# Altium project EMDO601_Patch.PrjPcb
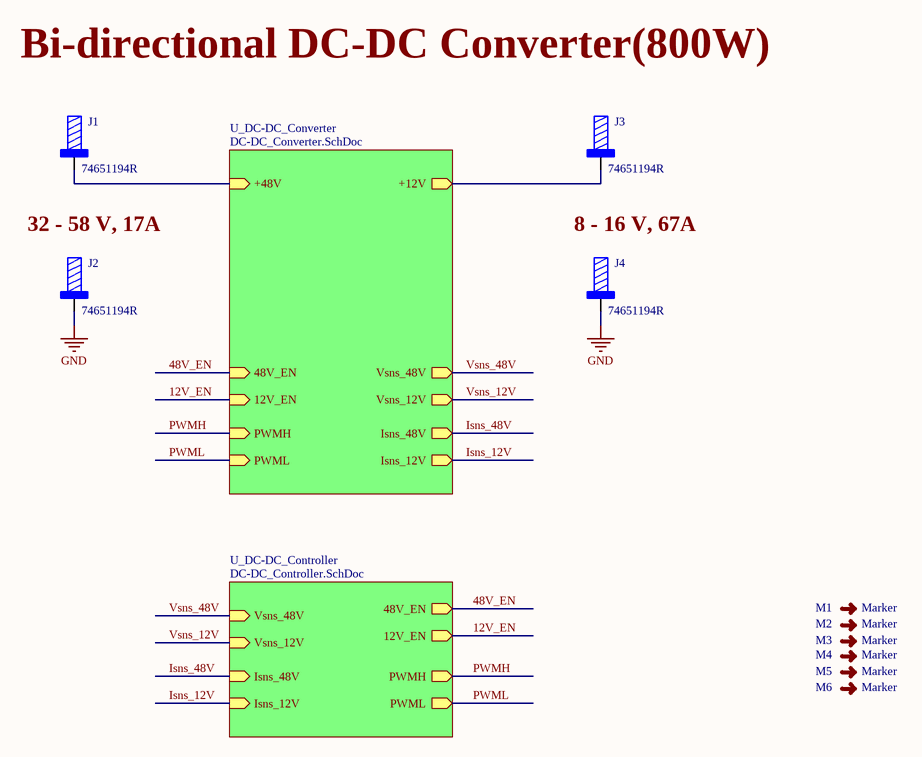
[diagram p0: Main.SchDoc]
1 sheet, 10 parts. Net scope: hierarchical (ports join the sheet entries above them; power ports are global).
Board file: EMDO601_Patch.PcbDoc

## Sheet Main.SchDoc: Balancer_48V
size A4; CompanyName: swissEmbedded GmbH; Organization: swissEmbedded GmbH; Address1: Landstrasse 18; Address2: 5415 Rieden; Address3: Switzerland; Address4: info@swissembedded.com; DocumentNumber: 1; Revision: A; SheetNumber: 1; SheetTotal: 27

### Parts
J1  74651194R  [74651194]
J2  74651194R  [74651194]
J3  74651194R  [74651194]
J4  74651194R  [74651194]
M1  Marker  [PASSER-KREIS]  (no BOM)
M2  Marker  [PASSER-KREIS]  (no BOM)
M3  Marker  [PASSER-KREIS]  (no BOM)
M4  Marker  [PASSER-KREIS]  (no BOM)
M5  Marker  [PASSER-KREIS]  (no BOM)
M6  Marker  [PASSER-KREIS]  (no BOM)

### Sub-sheets
U_DC-DC_Controller = DC-DC_Controller.SchDoc (file not in this document): Vsns_48V (in), Vsns_12V (in), Isns_48V (in), PWMH (out), PWML (out), 48V_EN (out), 12V_EN (out), Isns_12V (in)
U_DC-DC_Converter = DC-DC_Converter.SchDoc (file not in this document): +48V, +12V, PWMH (in), PWML (in), Vsns_48V (out), Vsns_12V (out), Isns_48V (out), 48V_EN (in), 12V_EN (in), Isns_12V (out)

### Nets
GND: J2.1 J4.1
12V_EN: sheet U_DC-DC_Converter/12V_EN, sheet U_DC-DC_Controller/12V_EN
48V_EN: sheet U_DC-DC_Converter/48V_EN, sheet U_DC-DC_Controller/48V_EN
Isns_12V: sheet U_DC-DC_Converter/Isns_12V, sheet U_DC-DC_Controller/Isns_12V
Isns_48V: sheet U_DC-DC_Converter/Isns_48V, sheet U_DC-DC_Controller/Isns_48V
PWMH: sheet U_DC-DC_Converter/PWMH, sheet U_DC-DC_Controller/PWMH
PWML: sheet U_DC-DC_Converter/PWML, sheet U_DC-DC_Controller/PWML
Vsns_12V: sheet U_DC-DC_Converter/Vsns_12V, sheet U_DC-DC_Controller/Vsns_12V
Vsns_48V: sheet U_DC-DC_Converter/Vsns_48V, sheet U_DC-DC_Controller/Vsns_48V
NetJ1_1: J1.1 ; sheet U_DC-DC_Converter/+48V
NetJ3_1: J3.1 ; sheet U_DC-DC_Converter/+12V

### Notes on the sheet
- Bi-directional DC-DC Converter(800W)
- 32 - 58 V, 17A
- 8 - 16 V, 67A
- Title
- Size:
- Date:
- A4
- Number:
- Time:
- Revision:
- Sheet
- /
- File:

### Library data of the parts
J1-J4 = 74651194R: WP-THRSH REDCUBE THR with external thread, M4 x 5mm, 85A; Manufacturer: Wurth Elektronik; Surface: Tin; ComponentLink1Description: Website Link; ComponentLink1URL: https://www.we-online.com/redexpert/article/74651194R?ad; ComponentLink2Description: Datasheet Link; ComponentLink2URL: https://www.we-online.com/redexpert/spec/74651194R?ad; Manufacturer Part Number: 74651194R; Category: REDCUBE THR; Match Code: WP-THRSH; Mount: Through Hole Reflow; Operating Temperature Max: 150°C; Operating Temperature Min: -55°C; Packaging: Tape and Reel; Length: 10mm; Width: 10mm; Height: 8.5mm; Material: Brass; Number of Pins: 9; Rated Current: 85A; Thread Length: 5mm; Thread Size: M4; Supplier: Mouser; Supplier Part Number: 710-74651195R; Price: 3.5; Value: 74651194R
M1-M6 = M: Text Field2: -1; Value: NB